# EAGLE design Main (EAGLE 6.3)
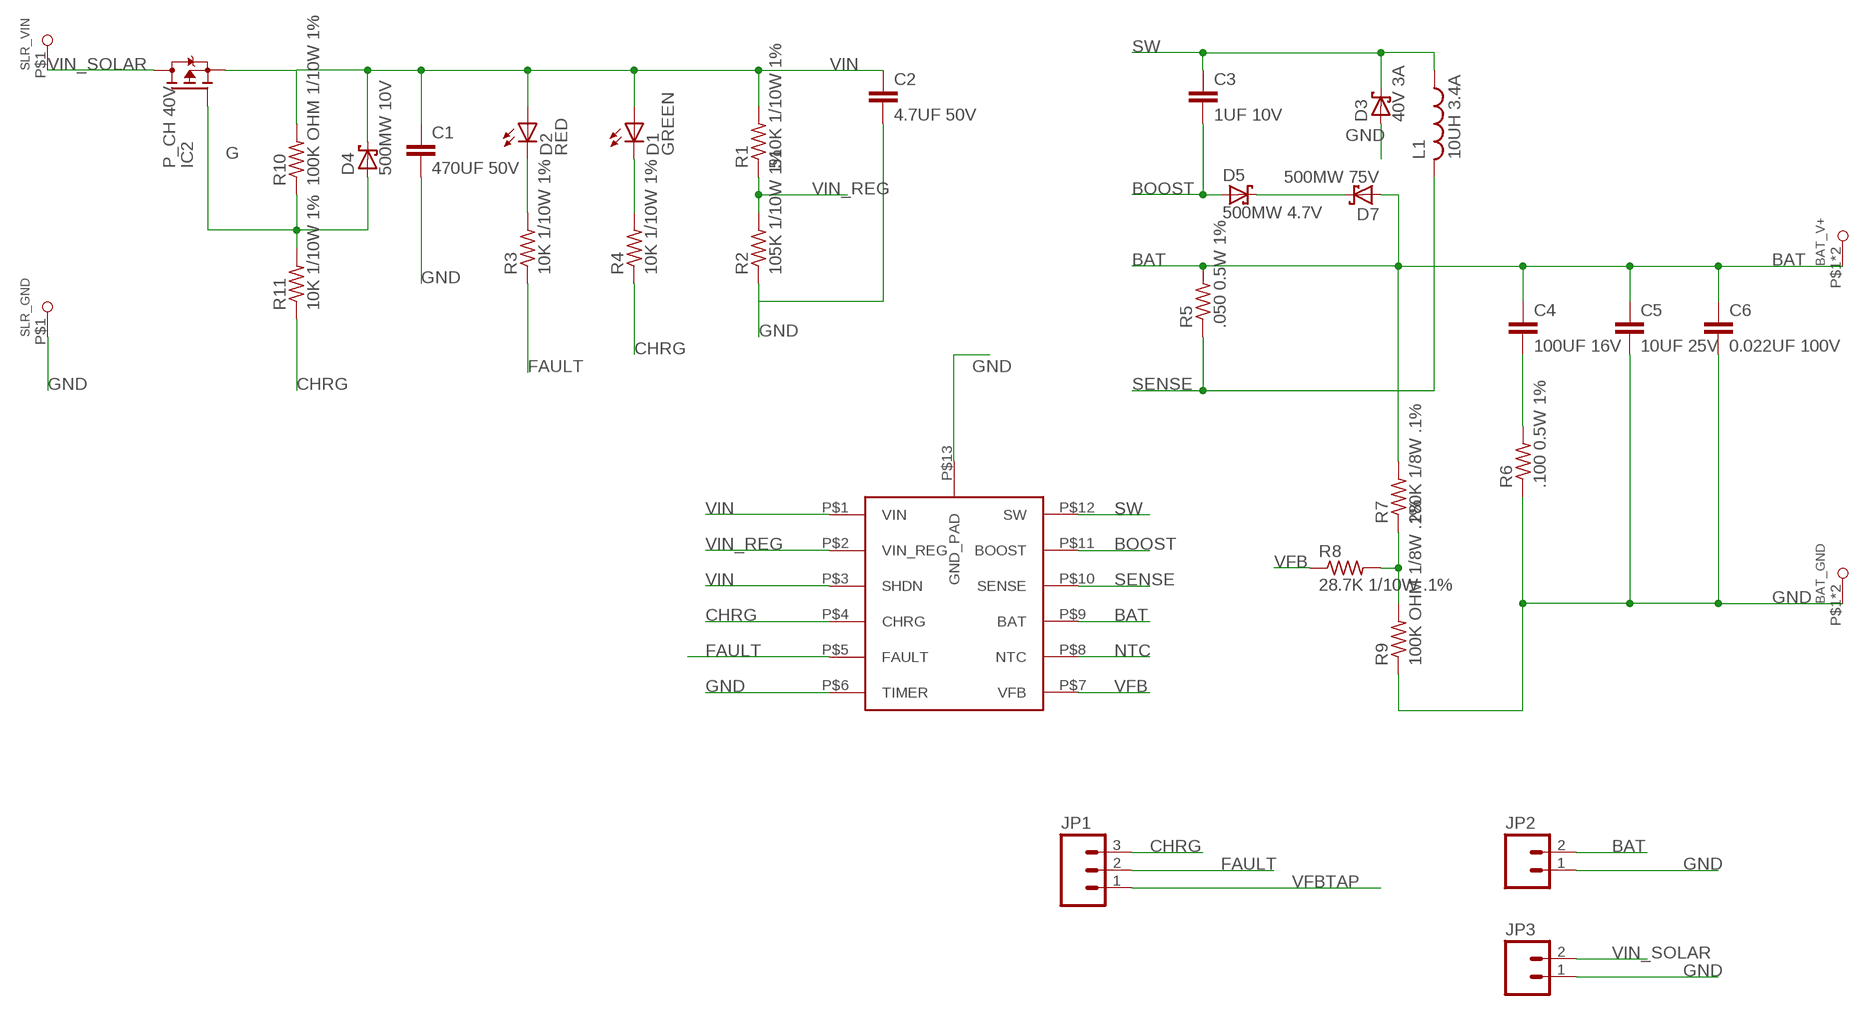
[diagram p0: schematic, sheet 1]

## Parts
BAT_GND  LARGE_PADMED_PAD_PAIR  [MEDIUM_PAD_PAIR]
BAT_V+  LARGE_PADMED_PAD_PAIR  [MEDIUM_PAD_PAIR]
C1  470UF 50V  SK471M050ST_(470µF_CAP)UPRIGHT_THROUGHHOLE  [5X5_CAP_HOLES]
C2  4.7UF 50V  C-EUC1210  [C1210]
C3  1UF 10V  C-EUC0805  [C0805]
C4  100UF 16V  C-EUC1210  [C1210]
C5  10UF 25V  C-EUC1210  [C1210]
C6  0.022UF 100V  C-EUC0805  [C0805]
D1  GREEN  LEDSML0603  [SML0603]
D2  RED  LEDSML0603  [SML0603]
D3  40V 3A  SCHOTTKY-DIODESMC  [SMC]
D4  500MW 10V  DIODE_MINIMELF  [MINIMELF]
D5  500MW 4.7V  DIODE_MINIMELF  [MINIMELF]
D7  500MW 75V  DIODE_MINIMELF  [MINIMELF]
IC1  LT3652MSE-12-MIGHT-BE-HAND-DOOABLE  [MSE_12_HANDSOLDERABLE]
IC2  P_CH 40V  MOSFET_P  [SO-8_SOIC8]
JP1  M03LOCK  [1X03_LOCK]
JP2  M02LOCK  [1X02_LOCK]
JP3  M02LOCK  [1X02_LOCK]
L1  10UH 3.4A  INDUCTOR  [ECOS_INDUCTOR_SMT]
R1  510K 1/10W 1%  R-US_R0603  [R0603]
R2  105K 1/10W 1%  R-US_R0603  [R0603]
R3  10K 1/10W 1%  R-US_R0603  [R0603]
R4  10K 1/10W 1%  R-US_R0603  [R0603]
R5  .050 0.5W 1%  R-US_R1206  [R1206]
R6  .100 0.5W 1%  R-US_R1206  [R1206]
R7  280K 1/8W .1%  R-US_R0805  [R0805]
R8  28.7K 1/10W .1%  R-US_R0603  [R0603]
R9  100K OHM 1/8W .1%  R-US_R0805  [R0805]
R10  100K OHM 1/10W 1%  R-US_R0603  [R0603]
R11  10K 1/10W 1%  R-US_R0603  [R0603]
SLR_GND  LARGE_PADMED_PAD  [MEDIUM_PAD]
SLR_VIN  LARGE_PADMED_PAD  [MEDIUM_PAD]

## Nets
BAT: BAT_V+.P$1(P1) BAT_V+.P$2(P1) C4.1 C5.1 C6.1 D7.P$1(A) IC1.P$9(BAT) JP2.2 R5.2 R7.2
BOOST: C3.2 D5.P$1(A) IC1.P$11(BOOST)
CHRG: IC1.P$4(CHRG) JP1.3 R4.1 R11.1
FAULT: IC1.P$5(FAULT) JP1.2 R3.1
G: D4.P$1(A) IC2.4(G) R10.1 R11.2
GND: BAT_GND.P$1(P1) BAT_GND.P$2(P1) C1.P$2 C2.2 C5.2 C6.2 D3.A IC1.P$6(TIMER) IC1.P$13(GND_PAD) JP2.1 JP3.1 R2.1 R6.1 R9.1 SLR_GND.P$1(P1)
N$1: D5.P$2(C) D7.P$2(C)
N$3: D2.C R3.2
N$4: D1.C R4.2
N$5: C4.2 R6.2
NTC: IC1.P$8(NTC)
SENSE: IC1.P$10(SENSE) L1.P$2 R5.1
SW: C3.1 D3.C IC1.P$12(SW) L1.P$1
VFB: IC1.P$7(VFB) R8.1
VFBTAP: JP1.1 R7.1 R8.2 R9.2
VIN: C1.P$1 C2.1 D1.A D2.A D4.P$2(C) IC1.P$1(VIN) IC1.P$3(SHDN) IC2.1(S) IC2.2(S) IC2.3(S) R1.2 R10.2
VIN_REG: IC1.P$2(VIN_REG) R1.1 R2.2
VIN_SOLAR: IC2.5(D) IC2.6(D) IC2.7(D) IC2.8(D) JP3.2 SLR_VIN.P$1(P1)

## Library data of the parts
BAT_GND BAT_V+ SLR_GND SLR_VIN = ARS:LARGE_PAD
C1 = ARS:SK471M050ST_(470µF_CAP)
C2-C6 = rcl:C-EU: CAPACITOR, European symbol
D1 D2 = led:LED: LED OSRAM: - CHIPLED LG R971, LG N971, LY N971, LG Q971, LY Q971, LO R971, LY R971 LH N974, LH R974 LS Q976, LO Q976, LY Q976 LO Q996 - Hyper CHIPLED LW Q18S LB Q993, LB Q99A, LB R99A - SideLED LS A670, LO A670, LY A670, LG A670, LP A670 LB A673, LV A673, LT A673, LW A673 LH A674 LY A675 LS A676, LA A676, LO A676, LY A676, LW A676 LS A679, LY A679, LG A679 - Hyper Micro SIDELED® LS Y876, LA Y876, LO Y876, LY Y876 LT Y87S - SmartLED LW L88C, LW L88S LB L89C, LB L89S, LG L890 LS L89K, LO L89K, LY L89K LS L896, LA L896, LO L896, LY L896 - TOPLED LS T670, LO T670, LY T670, LG T670, LP T670 LSG T670, LSP T670, LSY T670, LOP T670, LYG T670 LG T671, LOG T671, LSG T671 LB T673, LV T673, LT T673, LW T673 LH T674 LS T676, LA T676, LO T676, LY T676, LB T676, LH T676, LSB T676, LW T676 LB T67C, LV T67C, LT T67C, LS T67K, LO T67K, LY T67K, LW E67C LS E67B, LA E67B, LO E67B, LY E67B, LB E67C, LV E67C, LT E67C LW T67C LS T679, LY T679, LG T679 LS T770, LO T770, LY T770, LG T770, LP T770 LB T773, LV T773, LT T773, LW T773 LH T774 LS E675, LA E675, LY E675, LS T675 LS T776, LA T776, LO T776, LY T776, LB T776 LHGB T686 LT T68C, LB T68C - Hyper Mini TOPLED® LB M676 - Mini TOPLED Santana® LG M470 LS M47K, LO M47K, LY M47K Source: http://www.osram.convergy.de LUXEON: - LUMILED® LXK2-PW12-R00, LXK2-PW12-S00, LXK2-PW14-U00, LXK2-PW14-V00 LXK2-PM12-R00, LXK2-PM12-S00, LXK2-PM14-U00 LXK2-PE12-Q00, LXK2-PE12-R00, LXK2-PE12-S00, LXK2-PE14-T00, LXK2-PE14-U00 LXK2-PB12-K00, LXK2-PB12-L00, LXK2-PB12-M00, LXK2-PB14-N00, LXK2-PB14-P00, LXK2-PB14-Q00 LXK2-PR12-L00, LXK2-PR12-M00, LXK2-PR14-Q00, LXK2-PR14-R00 LXK2-PD12-Q00, LXK2-PD12-R00, LXK2-PD12-S00 LXK2-PH12-R00, LXK2-PH12-S00 LXK2-PL12-P00, LXK2-PL12-Q00, LXK2-PL12-R00 Source: www.luxeon.com KINGBRIGHT: KA-3528ASYC Source: www.kingbright.com
D3 = diode:SCHOTTKY-DIODE: Schottky Diode
D4 D5 D7 = ARS:DIODE_MINIMELF
IC1 = ARS:LT3652
IC2 = ARS:MOSFET_P
JP1 = SparkFun-Connectors:M03: Header 3 Standard 3-pin 0.1" header. Use with straight break away headers (SKU : PRT-00116), right angle break away headers (PRT-00553), swiss pins (PRT-00743), machine pins (PRT-00117), and female headers (PRT-00115). Molex polarized connector foot print use with SKU : PRT-08232 with associated crimp pins and housings.
JP2 JP3 = SparkFun-Connectors:M02: Header 2 Standard 2-pin 0.1" header. Use with straight break away headers (SKU : PRT-00116), right angle break away headers (PRT-00553), swiss pins (PRT-00743), machine pins (PRT-00117), and female headers (PRT-00115). Molex polarized connector foot print use with SKU : PRT-08233 with associated crimp pins and housings.
L1 = ARS:INDUCTOR
R1-R11 = rcl:R-US_: RESISTOR, American symbol

## Board
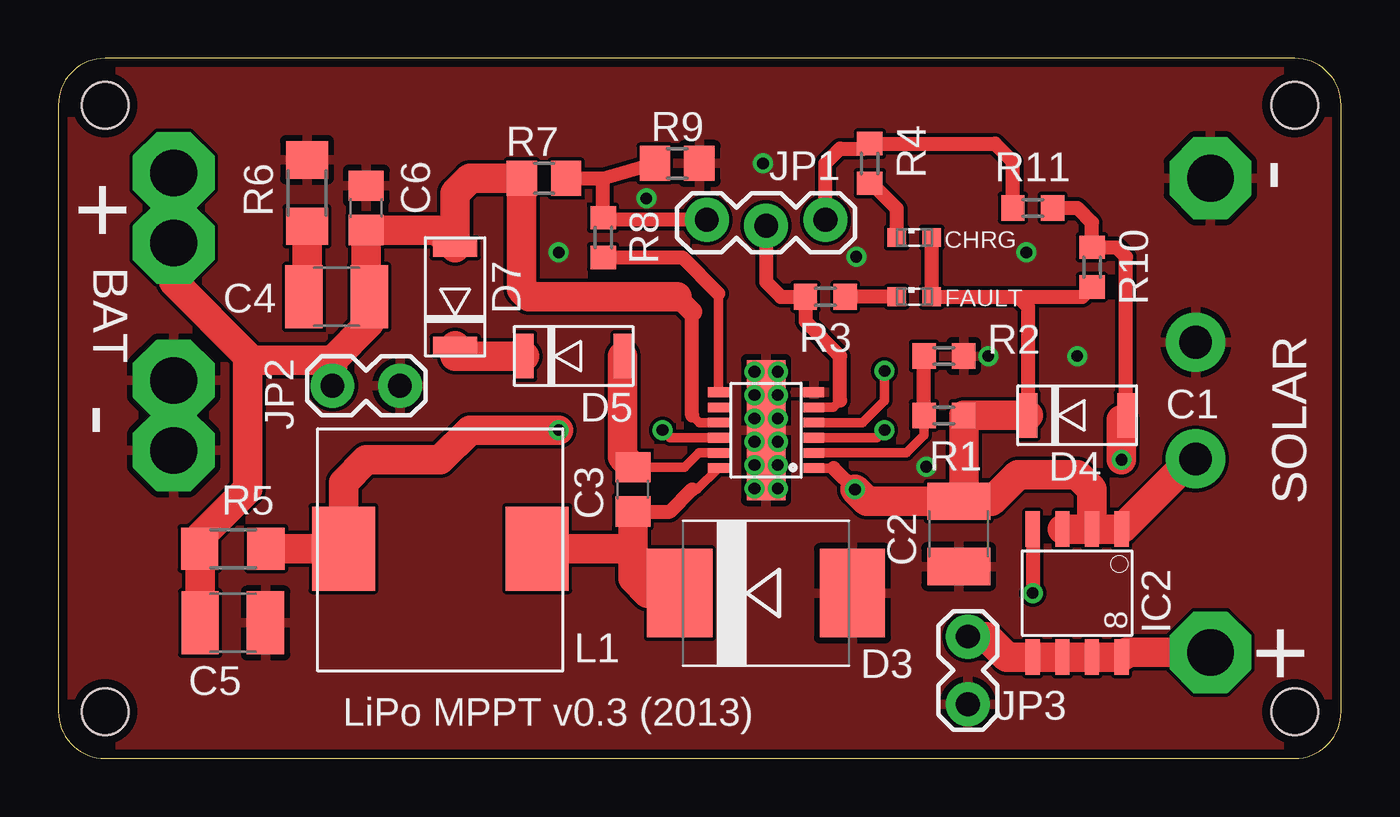
[diagram p1: board, top side]
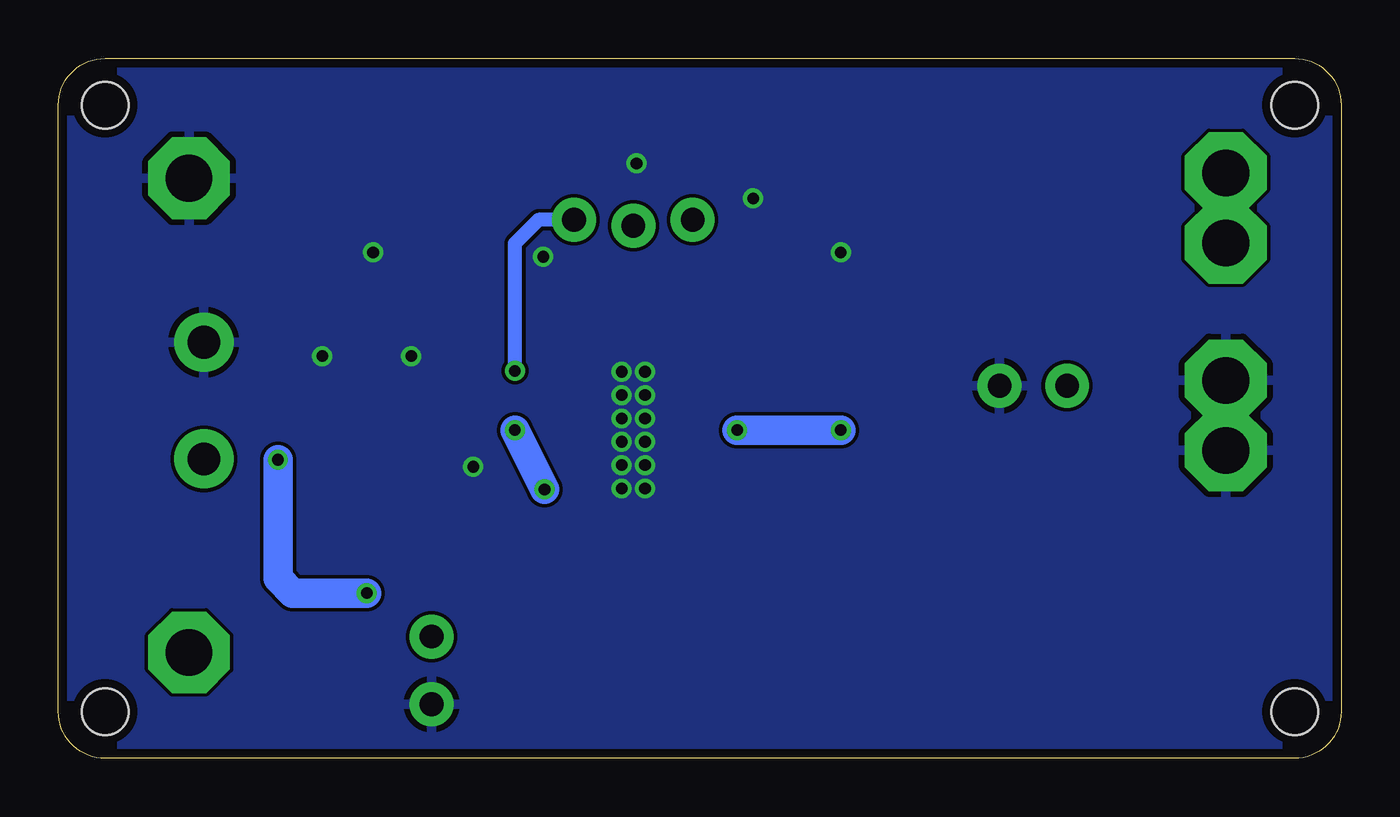
[diagram p2: board, bottom side, seen from below]

Size 55 x 30 mm. Coordinates in mm from the lower left corner, seen from the top.
Outline: 0,28 0,2 arc90 2,0 53,0 arc90 55,2 55,28 arc90 53,30 2,30 arc90 0,28
Copper layers (1*16): Top 0.0356mm / dielectric 1.5011mm / Bottom 0.0356mm
Design rules "LaenPCBOrder *": minimum track width 6mil, minimum drill 13mil, track to track 6mil, track to pad 6mil, pad to pad 6mil, via to via 6mil, smd to smd 6mil, copper to edge 15mil, drill to drill 6mil, minimum pad ring 7mil, minimum via ring 7mil, stop-mask expansion 3mil, vias tented up to drill 20mil, thermal gap 10mil
Holes 2 mm at 2,2 2,28 53,28 53,2

### Footprints (pad centres in the part's own frame; a part is rotated, then mirrored left to right if it is on the bottom)
MEDIUM_PAD_PAIR = drill 2 pad 3.5 octagon: P$1 0,-1.5; P$2 0,1.5
5X5_CAP_HOLES = drill 1.4 pad 2.54: P$1 0,2.5; P$2 0,-2.5
C1210 = smd 1.6 x 2.7: 1 -1.4,0; 2 1.4,0
C0805 = smd 1.3 x 1.5: 1 -0.95,0; 2 0.95,0
SML0603 = smd 0.8 x 0.8: A 0.75,0; C -0.75,0
SMC = smd 2.8 x 3.8: A 3.7,0; C -3.7,0
MINIMELF = smd 0.762 x 1.905: P$1 -2.095,0; P$2 2.095,0
MSE_12_HANDSOLDERABLE = smd 0.42 x 0.889: P$1 -1.625,-2.045; P$2 -0.975,-2.045; P$3 -0.325,-2.045; P$4 0.325,-2.045; P$5 0.975,-2.045; P$6 1.625,-2.045; P$7 1.625,2.045; P$8 0.975,2.045; P$9 0.325,2.045; P$10 -0.325,2.045; P$11 -0.975,2.045; P$12 -1.625,2.045 | smd 6 x 1.651: P$13 0,0
SO-8_SOIC8 = smd 1.524 x 0.61: 1 -2.743,1.905; 2 -2.743,0.635; 3 -2.743,-0.635; 4 -2.743,-1.905; 5 2.743,-1.905; 6 2.743,-0.635; 7 2.743,0.635; 8 2.743,1.905
1X03_LOCK = drill 1.016 pad 1.88: 1 0,0.127; 2 2.54,-0.127; 3 5.08,0.127
1X02_LOCK = drill 1.016 pad 1.88: 1 -0.178,0; 2 2.718,0
ECOS_INDUCTOR_SMT = smd 2.7 x 3.6: P$1 -4.15,0; P$2 4.15,0
R0603 = smd 1 x 1.1: 1 -0.85,0; 2 0.85,0
R1206 = smd 1.6 x 1.803: 1 -1.422,0; 2 1.422,0
R0805 = smd 1.3 x 1.5: 1 -0.95,0; 2 0.95,0
MEDIUM_PAD = drill 2 pad 3.5 octagon: P$1 0,0

### Placement (x,y rotation side)
BAT_GND  4.95,14.7 0 top
BAT_V+  4.95,23.59 0 top
C1  48.76,15.34 180 top
C2  38.6,9.62 270 top
C3  24.63,11.53 90 top
C4  11.93,19.78 180 top
C5  7.49,5.81 0 top
C6  13.2,23.59 90 top
D1  36.7,22.32 0 top
D2  36.7,19.78 0 top
D3  30.34,7.08 0 top
D4  43.68,14.7 180 top
D5  22.09,17.24 180 top
D7  17.01,19.78 270 top
IC1  30.34,14.06 90 top
IC2  43.68,7.08 270 top
JP1  27.8,22.95 0 top
JP2  14.47,15.97 180 top
JP3  39,2.5 90 top
L1  16.38,8.98 180 top
R1  37.97,14.7 0 top
R2  37.97,17.24 180 top
R3  32.88,19.78 0 top
R4  34.79,25.5 270 top
R5  7.49,8.98 180 top
R6  10.66,24.23 270 top
R7  20.82,24.86 180 top
R8  23.36,22.32 90 top
R9  26.54,25.5 180 top
R10  44.31,21.05 270 top
R11  41.77,23.59 0 top
SLR_GND  49.4,24.86 0 top
SLR_VIN  49.4,4.54 0 top

### Tracks (layer width: path | path; a pad name or v marks a point on that pad's centre or on a via)
BAT
  Top 0.406: IC1.P$9 27.48,14.39 27.17,14.7
  Top 0.61: 6.08,8.96 R5.2 | 27.17,14.7 27.17,19.14
  Top 0.889: 27.17,19.14 26.54,19.78
  Top 1.27: C5.1 6.08,8.96 | BAT_V+.P$2 BAT_V+.P$1 4.95,20.41 8.12,17.24 | 26.54,19.78 20.18,19.78 19.87,20.09 R7.2 17.64,24.86 17.01,24.23 D7.P$1 16.25,22.64 C6.1 13.2,19.91 C4.1 13.33,18.64 11.75,17.06 | JP2.2 11.75,17.06 | 8.12,17.24 8.12,11.53 6.06,9.47 R5.2 | 11.75,17.06 8.3,17.06 8.12,17.24
BOOST
  Top 0.406: IC1.P$11 27.46,13.09 26.85,12.47 C3.2
  Top 1.27: D5.P$1 24.19,12.92 C3.2
CHRG  (via drill 0.5)
  Top 0.406: IC1.P$4 34.48,14.39 35.42,15.34 v35.42,16.61
  Top 0.61: JP1.3 32.88,25.5 33.52,26.13 34.58,26.13 R4.1 40.16,26.34 40.92,25.57 R11.1
  Bottom 0.61: v35.42,16.61 35.42,22.07 34.42,23.08 JP1.3
FAULT
  Top 0.406: IC1.P$5 33.23,15.04 33.52,15.34
  Top 0.61: 33.52,15.34 33.52,17.24 32.03,18.73 R3.1 30.98,19.78 30.34,20.41 JP1.2
G  (via drill 0.5)
  Top 0.61: R11.2 43.68,23.59 44.31,22.95 R10.1 45.37,21.9 45.78,21.49 D4.P$1 45.59,14.51 | IC2.4 v41.77,7.08
  Top 1.27: v45.59,12.79 45.59,14.51
  Bottom 1.27: v41.77,7.08 44.95,7.08 45.59,7.71 v45.59,12.79
GND  (via drill 0.5)
  other vias: 39.87,17.24 43.68,17.24 41.51,21.68 21.45,21.68 30.21,25.5 29.84,13.56 30.84,13.56 30.84,15.56 29.84,15.56 29.84,14.56 30.84,14.56 30.84,12.56 29.84,12.56 29.84,16.57 30.84,16.57 30.84,11.56 29.84,11.56 34.21,21.5 25.21,24 37.21,12.49
  pour Top: -1.91,30.84 56.48,30.84 56.48,-1.91 -1.91,-1.91
  pour Bottom: -2.54,31.48 57.11,31.48 57.11,-2.54 -2.54,-2.54
N$1
  Top 1.27: D7.P$2 17.01,17.24 D5.P$2
N$3
  Top 0.61: D2.C R3.2
N$4
  Top 0.61: D1.C 35.95,23.55 34.85,24.64 R4.2
N$5
  Top 1.27: R6.2 10.66,19.91 C4.2
SENSE  (via drill 0.5)
  Top 0.406: IC1.P$10 26.23,13.74 v25.9,14.06
  Top 1.27: R5.1 L1.P$2 12.22,11.82 13.2,12.79 16.38,12.79 17.64,14.06 v21.45,14.06
  Bottom 1.27: v25.9,14.06 v21.45,14.06
SW
  Top 0.406: 27.17,11.53 27.39,11.53 IC1.P$12
  Top 0.61: C3.1 26.22,10.57 27.17,11.53
  Top 1.27: C3.1 24.63,8.98 | 24.63,8.98 24.63,7.71 25.27,7.08 D3.C | L1.P$1 24.63,8.98
VFB
  Top 0.406: 28.3,19.92 IC1.P$7
  Top 0.61: R8.1 26.75,21.47 28.3,19.92
VFBTAP
  Top 0.61: R7.1 23.36,24.86 | 23.36,24.86 R9.2 | 23.36,24.86 R8.2 23.45,23.08 JP1.1
VIN  (via drill 0.5)
  Top 0.406: IC1.P$1 33.24,12.44 | IC1.P$3 35.1,13.74 v35.42,14.06
  Top 0.61: D1.A D2.A 41.14,19.78 | 41.14,19.78 43.9,19.78 R10.2 | D4.P$2 41.58,19.34 41.14,19.78 | 38.81,11.23 C2.1 | 33.24,12.44 v34.16,11.53
  Top 1.27: C1.P$1 48.6,12.84 IC2.1 IC2.2 | IC2.2 IC2.3 | D4.P$2 R1.2 38.81,11.23 | IC2.2 44.31,11.53 43.68,12.16 41.14,12.16 40,11.02 C2.1 34.66,11.02 v34.16,11.53
  Bottom 1.27: v35.42,14.06 v34.16,11.53
VIN_REG
  Top 0.406: IC1.P$2 36.35,13.09 37.12,13.85 R1.1
  Top 0.61: R1.1 R2.2
VIN_SOLAR
  Top 1.27: SLR_VIN.P$1 45.79,4.54 IC2.8 IC2.7 IC2.6 IC2.5 40.66,4.34 39.78,5.22 JP3.2

### Text on the board
_tsilk: - | + | CHRG | FAULT | BAT | - | SOLAR | + | LiPo MPPT v0.3 (2013)